# EAGLE board LEDSubMatrixHighDensity_v2 (EAGLE 9.6.2), part 1 of 2
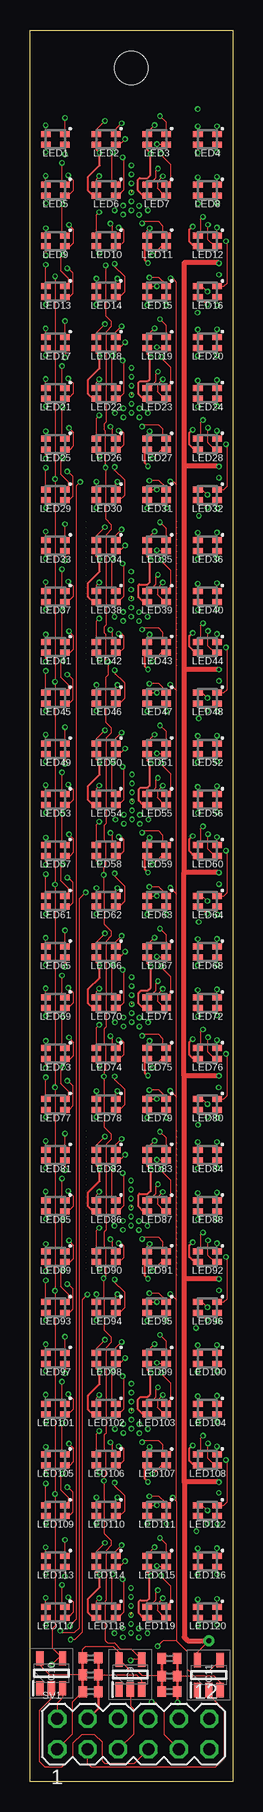
[diagram p2: board, top side]
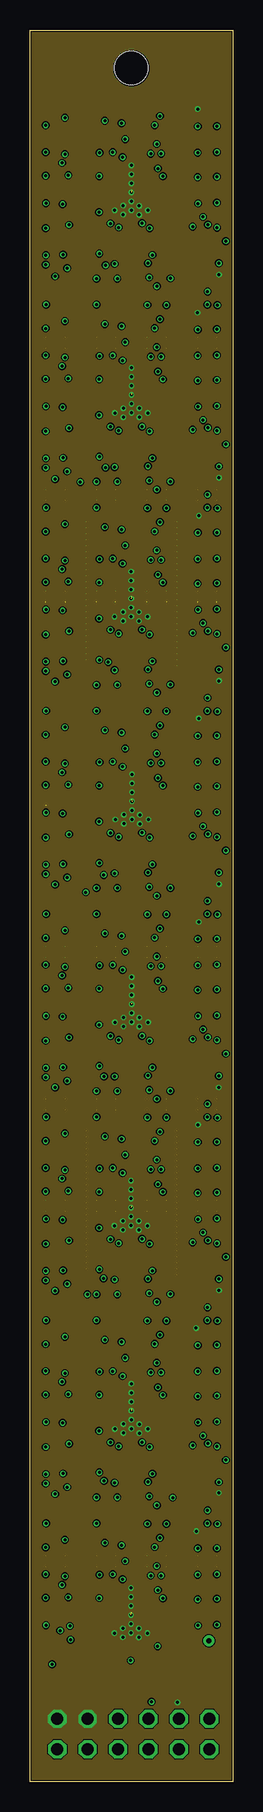
[diagram p3: board, inner layer InnerTop]
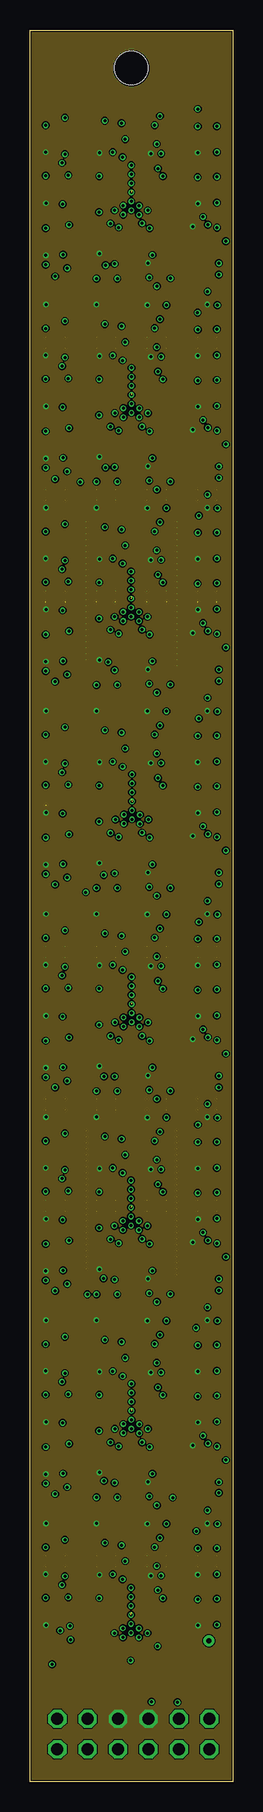
[diagram p4: board, inner layer InnerBottom]
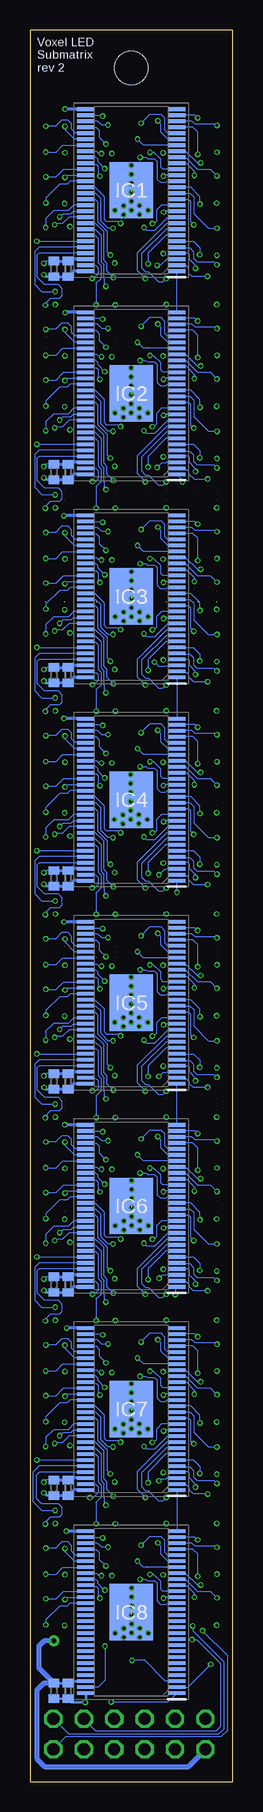
[diagram p5: board, bottom side, seen from below]

Size 16.93 x 146 mm. Coordinates in mm from the lower left corner, seen from the top.
Outline: 0,146 16.93,146 16.93,0 0,0 0,146
Copper layers (1+2*15+16): Top 0.035mm / dielectric 0.2mm / InnerTop 0.0175mm / dielectric 1.065mm / InnerBottom 0.0175mm / dielectric 0.2mm / Bottom 0.035mm
Design rules "jlcpcb_4layer_1oz": minimum track width 4mil, minimum drill 0.2mm, track to track 4mil, track to pad 0.2mm, pad to pad 5mil, via to via 6mil, smd to smd 5mil, copper to edge 5mil, drill to drill 0.5mm, minimum pad ring 10mil, minimum via ring 0.1mm, stop-mask expansion 0.1mm, vias tented up to drill 0mil, thermal gap 10mil
Holes 2.75 mm at 8.47,142.82

## Footprints (pad centres in the part's own frame; a part is rotated, then mirrored left to right if it is on the bottom)
C0402 = smd 0.7 x 0.9: 1 -0.65,0; 2 0.65,0
SOP50P810X120-57N = smd 1.475 x 0.3: 1 -3.788,6.75; 2 -3.788,6.25; 3 -3.788,5.75; 4 -3.788,5.25; 5 -3.788,4.75; 6 -3.788,4.25; 7 -3.788,3.75; 8 -3.788,3.25; 9 -3.788,2.75; 10 -3.788,2.25; 11 -3.788,1.75; 12 -3.788,1.25; 13 -3.788,0.75; 14 -3.788,0.25; 15 -3.788,-0.25; 16 -3.788,-0.75; 17 -3.788,-1.25; 18 -3.788,-1.75; 19 -3.788,-2.25; 20 -3.788,-2.75; 21 -3.788,-3.25; 22 -3.788,-3.75; 23 -3.788,-4.25; 24 -3.788,-4.75; 25 -3.788,-5.25; 26 -3.788,-5.75; 27 -3.788,-6.25; 28 -3.788,-6.75; 29 3.788,-6.75; 30 3.788,-6.25; 31 3.788,-5.75; 32 3.788,-5.25; 33 3.788,-4.75; 34 3.788,-4.25; 35 3.788,-3.75; 36 3.788,-3.25; 37 3.788,-2.75; 38 3.788,-2.25; 39 3.788,-1.75; 40 3.788,-1.25; 41 3.788,-0.75; 42 3.788,-0.25; 43 3.788,0.25; 44 3.788,0.75; 45 3.788,1.25; 46 3.788,1.75; 47 3.788,2.25; 48 3.788,2.75; 49 3.788,3.25; 50 3.788,3.75; 51 3.788,4.25; 52 3.788,4.75; 53 3.788,5.25; 54 3.788,5.75; 55 3.788,6.25; 56 3.788,6.75 | smd 3.61 x 4.7: 57 0,0
SOT95P280X145-5N = smd 1.2 x 0.6: 1 -1.25,0.95; 2 -1.25,0; 3 -1.25,-0.95; 4 1.25,-0.95; 5 1.25,0.95
B38G3RGB = smd 0.8 x 0.5: 1 0.8,0.45; 2 0.8,-0.45; 3 -0.8,-0.45; 4 -0.8,0.45
MA06-2 = drill 1.016 octagon: 1 -6.35,-1.27; 2 -6.35,1.27; 3 -3.81,-1.27; 4 -3.81,1.27; 5 -1.27,-1.27; 6 -1.27,1.27; 7 1.27,-1.27; 8 1.27,1.27; 9 3.81,-1.27; 10 3.81,1.27; 11 6.35,-1.27; 12 6.35,1.27

## Placement (x,y rotation side)
C1  .1uF  [C0402]  13.75,126.09 270 bottom
C1B  10uF  [C0402]  14.93,126.09 270 bottom
C2  .1uF  [C0402]  13.75,109.16 270 bottom
C2B  10uF  [C0402]  14.93,109.16 270 bottom
C3  .1uF  [C0402]  13.75,92.22 270 bottom
C3B  10uF  [C0402]  14.93,92.22 270 bottom
C4  .1uF  [C0402]  13.75,75.29 270 bottom
C4B  10uF  [C0402]  14.93,75.29 270 bottom
C5  .1uF  [C0402]  13.75,58.36 270 bottom
C5B  10uF  [C0402]  14.93,58.36 270 bottom
C6  .1uF  [C0402]  13.75,41.42 270 bottom
C6B  10uF  [C0402]  14.93,41.42 270 bottom
C7  .1uF  [C0402]  13.75,24.49 270 bottom
C7B  10uF  [C0402]  14.93,24.49 270 bottom
C8  .1uF  [C0402]  13.75,7.56 270 bottom
C8B  10uF  [C0402]  14.93,7.56 270 bottom
C28  0.1u  [C0402]  5.06,10.31 0 top
C29  4.7u  [C0402]  11.65,8.8 0 top
C30  0.1u  [C0402]  11.64,7.5 0 top
C31  4.7u  [C0402]  5.05,8.89 0 top
C32  0.1u  [C0402]  5.06,7.49 0 top
C33  4.7u  [C0402]  11.65,10.26 0 top
IC1  TLC5955DCAR  [SOP50P810X120-57N]  8.47,132.65 180 bottom
IC2  TLC5955DCAR  [SOP50P810X120-57N]  8.47,115.72 180 bottom
IC3  TLC5955DCAR  [SOP50P810X120-57N]  8.47,98.78 180 bottom
IC4  TLC5955DCAR  [SOP50P810X120-57N]  8.47,81.85 180 bottom
IC5  TLC5955DCAR  [SOP50P810X120-57N]  8.47,64.92 180 bottom
IC6  TLC5955DCAR  [SOP50P810X120-57N]  8.47,47.98 180 bottom
IC7  TLC5955DCAR  [SOP50P810X120-57N]  8.47,31.05 180 bottom
IC8  TLC5955DCAR  [SOP50P810X120-57N]  8.47,14.12 180 bottom
IC9  SN74LVC1G34DBVR  [SOT95P280X145-5N]  8.38,8.92 90 top
IC10  SN74LVC1G34DBVR  [SOT95P280X145-5N]  1.79,9.02 90 top
IC11  SN74LVC1G34DBVR  [SOT95P280X145-5N]  14.93,8.87 90 top
LED1  B38G3RGB  [B38G3RGB]  2.12,136.88 0 top
LED2  B38G3RGB  [B38G3RGB]  6.35,136.88 0 top
LED3  B38G3RGB  [B38G3RGB]  10.58,136.88 0 top
LED4  B38G3RGB  [B38G3RGB]  14.82,136.88 0 top
LED5  B38G3RGB  [B38G3RGB]  2.12,132.65 0 top
LED6  B38G3RGB  [B38G3RGB]  6.35,132.65 0 top
LED7  B38G3RGB  [B38G3RGB]  10.58,132.65 0 top
LED8  B38G3RGB  [B38G3RGB]  14.82,132.65 0 top
LED9  B38G3RGB  [B38G3RGB]  2.12,128.42 0 top
LED10  B38G3RGB  [B38G3RGB]  6.35,128.42 0 top
LED11  B38G3RGB  [B38G3RGB]  10.58,128.42 0 top
LED12  B38G3RGB  [B38G3RGB]  14.82,128.42 0 top
LED13  B38G3RGB  [B38G3RGB]  2.12,124.18 0 top
LED14  B38G3RGB  [B38G3RGB]  6.35,124.18 0 top
LED15  B38G3RGB  [B38G3RGB]  10.58,124.18 0 top
LED16  B38G3RGB  [B38G3RGB]  14.82,124.18 0 top
LED17  B38G3RGB  [B38G3RGB]  2.12,119.95 0 top
LED18  B38G3RGB  [B38G3RGB]  6.35,119.95 0 top
LED19  B38G3RGB  [B38G3RGB]  10.58,119.95 0 top
LED20  B38G3RGB  [B38G3RGB]  14.82,119.95 0 top
LED21  B38G3RGB  [B38G3RGB]  2.12,115.72 0 top
LED22  B38G3RGB  [B38G3RGB]  6.35,115.72 0 top
LED23  B38G3RGB  [B38G3RGB]  10.58,115.72 0 top
LED24  B38G3RGB  [B38G3RGB]  14.82,115.72 0 top
LED25  B38G3RGB  [B38G3RGB]  2.12,111.48 0 top
LED26  B38G3RGB  [B38G3RGB]  6.35,111.48 0 top
LED27  B38G3RGB  [B38G3RGB]  10.58,111.48 0 top
LED28  B38G3RGB  [B38G3RGB]  14.82,111.48 0 top
LED29  B38G3RGB  [B38G3RGB]  2.12,107.25 0 top
LED30  B38G3RGB  [B38G3RGB]  6.35,107.25 0 top
LED31  B38G3RGB  [B38G3RGB]  10.58,107.25 0 top
LED32  B38G3RGB  [B38G3RGB]  14.82,107.25 0 top
LED33  B38G3RGB  [B38G3RGB]  2.12,103.02 0 top
LED34  B38G3RGB  [B38G3RGB]  6.35,103.02 0 top
LED35  B38G3RGB  [B38G3RGB]  10.58,103.02 0 top
LED36  B38G3RGB  [B38G3RGB]  14.82,103.02 0 top
LED37  B38G3RGB  [B38G3RGB]  2.12,98.78 0 top
LED38  B38G3RGB  [B38G3RGB]  6.35,98.78 0 top
LED39  B38G3RGB  [B38G3RGB]  10.58,98.78 0 top
LED40  B38G3RGB  [B38G3RGB]  14.82,98.78 0 top
LED41  B38G3RGB  [B38G3RGB]  2.12,94.55 0 top
LED42  B38G3RGB  [B38G3RGB]  6.35,94.55 0 top
LED43  B38G3RGB  [B38G3RGB]  10.58,94.55 0 top
LED44  B38G3RGB  [B38G3RGB]  14.82,94.55 0 top
LED45  B38G3RGB  [B38G3RGB]  2.12,90.32 0 top
LED46  B38G3RGB  [B38G3RGB]  6.35,90.32 0 top
LED47  B38G3RGB  [B38G3RGB]  10.58,90.32 0 top
LED48  B38G3RGB  [B38G3RGB]  14.82,90.32 0 top
LED49  B38G3RGB  [B38G3RGB]  2.12,86.08 0 top
LED50  B38G3RGB  [B38G3RGB]  6.35,86.08 0 top
LED51  B38G3RGB  [B38G3RGB]  10.58,86.08 0 top
LED52  B38G3RGB  [B38G3RGB]  14.82,86.08 0 top
LED53  B38G3RGB  [B38G3RGB]  2.12,81.85 0 top
LED54  B38G3RGB  [B38G3RGB]  6.35,81.85 0 top
LED55  B38G3RGB  [B38G3RGB]  10.58,81.85 0 top
LED56  B38G3RGB  [B38G3RGB]  14.82,81.85 0 top
LED57  B38G3RGB  [B38G3RGB]  2.12,77.62 0 top
LED58  B38G3RGB  [B38G3RGB]  6.35,77.62 0 top
LED59  B38G3RGB  [B38G3RGB]  10.58,77.62 0 top
LED60  B38G3RGB  [B38G3RGB]  14.82,77.62 0 top
LED61  B38G3RGB  [B38G3RGB]  2.12,73.38 0 top
LED62  B38G3RGB  [B38G3RGB]  6.35,73.38 0 top
LED63  B38G3RGB  [B38G3RGB]  10.58,73.38 0 top
LED64  B38G3RGB  [B38G3RGB]  14.82,73.38 0 top
LED65  B38G3RGB  [B38G3RGB]  2.12,69.15 0 top
LED66  B38G3RGB  [B38G3RGB]  6.35,69.15 0 top
LED67  B38G3RGB  [B38G3RGB]  10.58,69.15 0 top
LED68  B38G3RGB  [B38G3RGB]  14.82,69.15 0 top
LED69  B38G3RGB  [B38G3RGB]  2.12,64.92 0 top
LED70  B38G3RGB  [B38G3RGB]  6.35,64.92 0 top
LED71  B38G3RGB  [B38G3RGB]  10.58,64.92 0 top
LED72  B38G3RGB  [B38G3RGB]  14.82,64.92 0 top
LED73  B38G3RGB  [B38G3RGB]  2.12,60.68 0 top
LED74  B38G3RGB  [B38G3RGB]  6.35,60.68 0 top
LED75  B38G3RGB  [B38G3RGB]  10.58,60.68 0 top
LED76  B38G3RGB  [B38G3RGB]  14.82,60.68 0 top
LED77  B38G3RGB  [B38G3RGB]  2.12,56.45 0 top
LED78  B38G3RGB  [B38G3RGB]  6.35,56.45 0 top
LED79  B38G3RGB  [B38G3RGB]  10.58,56.45 0 top
LED80  B38G3RGB  [B38G3RGB]  14.82,56.45 0 top
LED81  B38G3RGB  [B38G3RGB]  2.12,52.22 0 top
LED82  B38G3RGB  [B38G3RGB]  6.35,52.22 0 top
LED83  B38G3RGB  [B38G3RGB]  10.58,52.22 0 top
LED84  B38G3RGB  [B38G3RGB]  14.82,52.22 0 top
LED85  B38G3RGB  [B38G3RGB]  2.12,47.98 0 top
LED86  B38G3RGB  [B38G3RGB]  6.35,47.98 0 top
LED87  B38G3RGB  [B38G3RGB]  10.58,47.98 0 top
LED88  B38G3RGB  [B38G3RGB]  14.82,47.98 0 top
LED89  B38G3RGB  [B38G3RGB]  2.12,43.75 0 top
LED90  B38G3RGB  [B38G3RGB]  6.35,43.75 0 top
LED91  B38G3RGB  [B38G3RGB]  10.58,43.75 0 top
LED92  B38G3RGB  [B38G3RGB]  14.82,43.75 0 top
LED93  B38G3RGB  [B38G3RGB]  2.12,39.52 0 top
LED94  B38G3RGB  [B38G3RGB]  6.35,39.52 0 top
LED95  B38G3RGB  [B38G3RGB]  10.58,39.52 0 top
LED96  B38G3RGB  [B38G3RGB]  14.82,39.52 0 top
LED97  B38G3RGB  [B38G3RGB]  2.12,35.28 0 top
LED98  B38G3RGB  [B38G3RGB]  6.35,35.28 0 top
LED99  B38G3RGB  [B38G3RGB]  10.58,35.28 0 top
LED100  B38G3RGB  [B38G3RGB]  14.82,35.28 0 top
LED101  B38G3RGB  [B38G3RGB]  2.12,31.05 0 top
LED102  B38G3RGB  [B38G3RGB]  6.35,31.05 0 top
LED103  B38G3RGB  [B38G3RGB]  10.58,31.05 0 top
LED104  B38G3RGB  [B38G3RGB]  14.82,31.05 0 top
LED105  B38G3RGB  [B38G3RGB]  2.12,26.82 0 top
LED106  B38G3RGB  [B38G3RGB]  6.35,26.82 0 top
LED107  B38G3RGB  [B38G3RGB]  10.58,26.82 0 top
LED108  B38G3RGB  [B38G3RGB]  14.82,26.82 0 top
LED109  B38G3RGB  [B38G3RGB]  2.12,22.58 0 top
LED110  B38G3RGB  [B38G3RGB]  6.35,22.58 0 top
LED111  B38G3RGB  [B38G3RGB]  10.58,22.58 0 top
LED112  B38G3RGB  [B38G3RGB]  14.82,22.58 0 top
LED113  B38G3RGB  [B38G3RGB]  2.12,18.35 0 top
LED114  B38G3RGB  [B38G3RGB]  6.35,18.35 0 top
LED115  B38G3RGB  [B38G3RGB]  10.58,18.35 0 top
LED116  B38G3RGB  [B38G3RGB]  14.82,18.35 0 top
LED117  B38G3RGB  [B38G3RGB]  2.12,14.12 0 top
LED118  B38G3RGB  [B38G3RGB]  6.35,14.12 0 top
LED119  B38G3RGB  [B38G3RGB]  10.58,14.12 0 top
LED120  B38G3RGB  [B38G3RGB]  14.82,14.12 0 top
SV1  [MA06-2]  8.63,3.95 0 top

## Tracks (layer width: path | path; a pad name or v marks a point on that pad's centre or on a via)
3V3  (via drill 0.25)  (29 unrouted)
  Top 0.152: LED1.3 v1.32,135.81 | LED2.3 5.55,136.03 v5.82,135.76 5.82,134.73 4.87,133.78 4.87,132.6 5.27,132.2 LED6.3 | LED3.3 9.78,136 v10.09,135.7 10.02,135.63 10.02,133.84 9.83,133.65 9.16,133.65 9.04,133.53 9.04,132.61 9.45,132.2 LED7.3 | LED5.3 1.34,132.18 v1.34,131.56 | LED9.3 1.32,127.24 v1.33,127.22 | LED10.3 5.55,127.61 v5.79,127.36 | v9.85,126.57 9.57,126.85 9.57,127.75 LED11.3 | LED15.3 9.78,123.1 v9.8,123.08 | LED14.3 v5.55,123.12 | LED13.3 1.32,123.14 v1.34,123.12 | v14.81,123.11 14.19,123.73 LED16.3 | LED8.3 14.02,131.56 v14.04,131.54 | LED4.3 14,136.42 v14,135.77 | LED12.3 13.68,127.97 13.29,128.36 13.29,129.36 13.54,129.61 v13.59,129.61 | LED17.3 v1.32,118.88 | LED18.3 5.55,119.09 v5.82,118.83 5.82,117.79 4.87,116.85 4.87,115.67 5.27,115.27 LED22.3 | LED19.3 9.78,119.07 v10.09,118.77 9.98,118.66 9.98,116.87 9.83,116.72 9.17,116.72 9.08,116.62 9.08,115.64 9.45,115.27 LED23.3 | LED21.3 1.34,115.24 v1.34,114.63 | LED25.3 1.32,110.3 v1.33,110.29 | LED26.3 5.55,110.67 v5.79,110.43 | v9.85,109.64 9.57,109.92 9.57,110.82 LED27.3 | LED31.3 9.78,106.16 v9.8,106.15 | LED30.3 v5.55,106.19 v5.55,106.18 | LED29.3 1.32,106.21 v1.34,106.18 | v14.81,106.17 14.19,106.8 LED32.3 | LED24.3 14.02,114.62 v14.04,114.6 | LED20.3 14,119.49 v14,118.84 | LED28.3 13.71,111.03 13.32,111.42 13.32,112.45 13.54,112.68 v13.59,112.68 | LED33.3 v1.32,101.95 | LED34.3 5.55,102.16 v5.82,101.89 5.82,100.86 4.87,99.91 4.87,98.73 5.27,98.33 LED38.3 | LED35.3 9.78,102.13 v10.09,101.83 10,101.74 10,99.95 9.83,99.78 9.15,99.78 9.06,99.7 9.06,98.73 9.45,98.33 LED39.3 | LED37.3 1.34,98.31 v1.34,97.69 | LED41.3 1.32,93.37 v1.33,93.36
  Top 0.152: LED42.3 5.55,93.74 v5.79,93.5 | v9.85,92.7 9.57,92.98 9.57,93.88 LED43.3 | LED47.3 9.78,89.23 v9.8,89.21 | LED46.3 v5.55,89.25 | LED45.3 1.32,89.28 v1.34,89.25 | v14.81,89.24 14.19,89.87 LED48.3 | LED40.3 14.02,97.69 v14.04,97.67 | LED36.3 14,102.55 v14,101.91 | LED44.3 13.81,94.1 13.29,94.62 13.29,95.49 13.54,95.75 v13.59,95.75 | LED49.3 v1.32,85.02 | LED50.3 5.55,85.22 v5.82,84.96 5.82,83.93 4.87,82.98 4.87,81.8 5.27,81.4 LED54.3 | LED51.3 9.78,85.2 v10.09,84.9 9.99,84.8 9.99,83.01 9.83,82.85 9.21,82.85 9.09,82.73 9.09,81.77 9.45,81.4 LED55.3 | 1.34,81.38 v1.34,80.76 | LED57.3 1.32,76.44 v1.33,76.42 | LED58.3 5.55,76.81 v5.79,76.56 | v9.85,75.77 9.57,76.05 9.57,76.95 LED59.3 | LED63.3 9.78,72.3 v9.8,72.28 | LED62.3 v5.55,72.32 | LED61.3 1.32,72.34 v1.34,72.32 | v14.81,72.31 14.19,72.93 LED64.3 | v14.04,80.74 14.02,80.75 LED56.3 | LED52.3 14,85.62 v14,84.97 | LED60.3 13.71,77.17 13.31,77.56 13.31,78.58 13.54,78.81 v13.59,78.81 | LED65.3 v1.32,68.08 | LED66.3 5.55,68.29 v5.82,68.03 5.82,66.99 4.87,66.05 4.87,64.87 5.27,64.47 LED70.3 | LED67.3 9.78,68.27 v10.09,67.97 10.06,67.94 10.06,66.15 9.83,65.92 9.27,65.92 9.07,65.72 9.07,64.85 9.45,64.47 LED71.3 | LED69.3 1.34,64.44 v1.34,63.83 | LED73.3 1.32,59.5 v1.33,59.49 | LED74.3 5.55,59.88 v5.79,59.63 | v9.85,58.84 9.57,59.12 9.57,60.02 LED75.3 | LED79.3 9.78,55.36 v9.8,55.35 | LED78.3 v5.55,55.39 v5.55,55.38 | LED77.3 1.32,55.41 v1.34,55.38 | v14.81,55.38 14.19,56 LED80.3 | LED72.3 14.02,63.82 v14.04,63.8 | LED68.3 14,68.69 v14,68.04 | LED76.3 13.64,60.23 13.33,60.55 13.33,61.66 13.54,61.88 v13.59,61.88 | LED81.3 v1.32,51.15 | LED82.3 5.55,51.36 v5.82,51.09 5.82,50.06 4.87,49.11 4.87,47.93 5.27,47.53 LED86.3
  Top 0.152: LED83.3 9.78,51.33 v10.09,51.03 10.06,51.01 10.06,49.22 9.83,48.98 9.15,48.98 9.07,48.91 9.07,47.92 9.45,47.53 LED87.3 | LED85.3 1.34,47.51 v1.34,46.89 | LED89.3 1.32,42.57 v1.33,42.56 | LED90.3 5.55,42.94 v5.79,42.7 | v9.85,41.9 9.57,42.19 9.57,43.08 LED91.3 | LED95.3 9.78,38.43 v9.8,38.41 | LED94.3 v5.55,38.45 | LED93.3 1.32,38.47 v1.34,38.45 | v14.81,38.44 14.19,39.07 LED96.3 | LED88.3 14.02,46.89 v14.04,46.87 | LED84.3 14,51.75 v14,51.11 | LED92.3 13.72,43.3 13.3,43.72 13.3,44.7 13.54,44.94 v13.59,44.94 | LED97.3 v1.32,34.22 | LED98.3 5.55,34.42 v5.82,34.16 5.82,33.13 4.87,32.18 4.87,31 5.27,30.6 LED102.3 | LED99.3 9.78,34.4 v10.09,34.1 10.01,34.02 10.01,32.23 9.83,32.05 9.23,32.05 9.04,31.86 9.04,31.01 9.45,30.6 LED103.3 | LED101.3 1.34,30.58 v1.34,29.96 | LED105.3 1.32,25.64 v1.33,25.62 | LED106.3 5.55,26.01 v5.79,25.77 | v9.85,24.97 9.57,25.25 9.57,26.15 LED107.3 | LED111.3 9.78,21.5 v9.8,21.48 | LED110.3 v5.55,21.52 | LED109.3 1.32,21.54 v1.34,21.52 | v14.81,21.51 14.19,22.13 LED112.3 | LED104.3 14.02,29.95 v14.04,29.94 | LED100.3 14,34.82 v14,34.17 | LED108.3 13.68,26.37 13.3,26.75 13.3,27.77 13.54,28.01 v13.59,28.01 | LED113.3 v1.32,17.28 | LED114.3 5.55,17.49 v5.82,17.23 5.82,16.19 4.87,15.25 4.87,14.07 5.27,13.67 LED118.3 | LED115.3 9.78,17.47 v10.09,17.16 9.94,17.02 9.94,15.23 9.83,15.12 9.2,15.12 9.1,15.01 9.1,14.03 9.45,13.67 LED119.3 | LED117.3 1.34,13.64 v1.34,13.03 | LED120.3 14.02,13.02 v14.04,13 | LED116.3 14,17.89 v14,17.24
  pour InnerBottom (no thermals): -17,163 34,163 34,-24 -17,-24
3V3_LOGIC  (via drill 0.25, 0.4 pad 0.9)  (2 unrouted)
  Top 0.102: SV1.1 3.58,3.98 3.58,6.65 C32.1 | C31.1 1.63,8.89 0.84,9.68 IC10.5 | C28.1 4.41,11.01 4.66,11.26 6.94,11.26 7.43,10.77 IC9.5 8.42,9.18 9.02,9.18 9.4,8.8 C29.1 | IC11.5 13.98,10.78 v14.93,11.73
  Top 0.203: C28.1 C31.1 4.41,8.88 C32.1 | C33.1 C29.1 11,7.51 C30.1
  Top 0.406: v15.78,126.56 15.75,126.59 12.86,126.59 12.86,109.63 | v15.78,109.62 v15.78,109.63 12.86,109.63 | v15.78,92.69 12.86,92.69 | v15.78,75.76 12.86,75.76 | 12.86,58.83 12.86,75.76 | v15.78,58.83 12.86,58.83 | v15.78,41.89 12.86,41.89 | v15.78,24.96 12.89,24.96 | 12.89,24.96 12.86,24.96 12.86,41.89 | 12.89,24.96 12.89,12.04 13.21,11.73 v14.93,11.73 | 12.86,109.63 12.86,92.69 | 12.86,92.69 12.86,75.76 | 12.86,58.83 12.86,41.89
  Bottom 0.102: C1B.1 15.6,126.74 v15.78,126.56 | C2B.1 15.6,109.81 v15.78,109.62 | C3B.1 15.6,92.87 v15.78,92.69 | C4B.1 15.6,75.94 v15.78,75.76 | C5B.1 15.6,59.01 v15.78,58.83 | C6B.1 15.6,42.07 v15.78,41.89 | C7B.1 15.6,25.14 v15.78,24.96
  Bottom 0.203: IC8.54 13.59,8.37 C8.1 C8B.1
  Bottom 0.254: IC1.54 13.59,126.9 C1.1 C1B.1 | IC2.54 13.59,109.97 C2.1 C2B.1 | IC3.54 13.59,93.03 C3.1 C3B.1 | IC4.54 13.59,76.1 C4.1 C4B.1 | IC5.54 13.59,59.17 C5.1 C5B.1 | IC6.54 13.59,42.23 C6.1 C6B.1 | IC7.54 13.59,25.3 C7.1 C7B.1
  Bottom 0.406: v14.93,11.73 15.74,11.73 16.19,11.28 16.19,9.46 C8B.1 15.78,8.21 16.37,7.62 16.37,1.9 15.72,1.25 3.7,1.25 2.28,2.67 SV1.1
GND  (via drill 0.25)  (8 unrouted)
  Top 0.102: IC10.3 2.74,6.96 2.28,6.5 SV1.2 | C31.2 8.89,8.89 9.33,8.44 IC9.3 | C29.2 15.37,8.8 15.88,8.28 IC11.3
  Top 0.203: C28.2 C31.2 C32.2 5.71,6.12 SV1.4 | C33.2 C29.2 12.3,7.51 C30.2 12.29,6.63 v12.32,6.6
  Bottom 0.203: C7B.2 15.55,23.84 v15.77,24.06 | C6B.2 15.61,40.77 v15.78,40.94 | C5B.2 15.61,57.71 v15.76,57.86 | C4B.2 15.61,74.64 v15.78,74.81 | C3B.2 15.61,91.57 v15.78,91.74 | C2B.2 15.61,108.51 v15.78,108.67 | C1B.2 15.61,125.44 v15.78,125.61 | IC8.56 12.26,6.67 v12.32,6.6 13.44,6.6 C8.2 C8B.2
  Bottom 0.254: v14.02,139.42 14,139.4 IC1.29 | C1B.2 C1.2 13.29,125.9 IC1.56 | IC2.56 13.29,108.97 C2.2 C2B.2 | IC3.56 13.29,92.03 C3.2 C3B.2 | IC3.29 14.08,105.53 v14.1,105.52 | IC4.29 14.08,88.6 v14.1,88.62 | IC4.56 13.29,75.1 C4.2 C4B.2 | IC5.29 14.08,71.67 v14.1,71.65 | IC5.56 13.29,58.17 C5.2 C5B.2 | IC6.29 14.01,54.73 v14.03,54.75 | IC6.56 13.29,41.23 C6.2 C6B.2 | IC7.29 v13.86,37.8 v13.87,37.81 | C7B.2 C7.2 13.29,24.3 IC7.56 | IC8.29 v13.89,20.87 v13.9,20.87 | IC2.29 13.97,122.47 v14,122.44
  other vias: 8.46,134.72 8.46,133.97 8.46,133.22 8.46,132.47 8.46,131.72 8.46,130.97 9.12,131.35 7.79,131.36 7.79,130.61 9.12,130.6 7.07,130.96 9.83,130.96 8.44,16.14 8.44,15.39 8.44,14.64 8.44,13.89 8.44,13.14 8.44,12.39 9.09,12.76 7.76,12.77 7.76,12.02 9.09,12.01 7.05,12.37 9.81,12.37 8.47,33.16 8.47,32.41 8.47,31.66 8.47,30.91 8.47,30.16 8.47,29.41 9.13,29.78 7.8,29.8 7.8,29.05 9.13,29.03 7.08,29.39 9.84,29.39 8.44,50.09 8.44,49.34 8.44,48.59 8.44,47.84 8.44,47.09 8.44,46.34 9.09,46.72 7.76,46.73 7.76,45.98 9.09,45.97 7.05,46.33 9.81,46.33 8.49,67.05 8.49,66.3 8.49,65.55 8.49,64.8 8.49,64.05 8.49,63.3 9.14,63.67 7.81,63.69 7.81,62.94 9.14,62.92 7.1,63.28 9.86,63.28 8.52,83.95 8.52,83.2 8.52,82.45 8.52,81.7 8.52,80.95 8.52,80.2 9.18,80.58 7.85,80.59 7.85,79.84 9.18,79.83 7.14,80.19 9.9,80.19 8.45,100.85 8.45,100.1 8.45,99.35 8.45,98.6 8.45,97.85 8.45,97.1 9.11,97.48 7.78,97.49 7.78,96.74 9.11,96.73 7.06,97.09 9.82,97.09 8.48,117.83 8.48,117.08 8.48,116.33 8.48,115.58 8.48,114.83 8.48,114.08 9.13,114.46 7.8,114.47 7.8,113.72 9.13,113.71 7.09,114.07 9.85,114.07
  pour InnerTop (no thermals): -16,162 32,162 32,82 32,-14 -16,-14
GSCLK  (via drill 0.25)
  Top 0.102: IC11.4 14.95,9.19 13.31,9.19 13.14,9.36 13.14,10.81 12.22,11.72 | 12.22,23.36 12.22,11.72 | 12.22,23.36 12.22,40.13 | 12.22,40.13 12.22,57.06 | 12.22,57.06 12.22,74 | 12.22,74 12.22,90.93 | 12.22,90.93 12.22,108.12 | 12.22,108.12 12.22,125 11.93,125.29 v11.74,125.29 | v11.72,108.37 11.97,108.37 12.22,108.12 | v11.72,91.43 12.22,90.93 | v11.73,74.49 12.22,74 | v11.72,57.57 12.22,57.06 | v11.72,40.63 12.22,40.13 | v11.92,23.66 12.22,23.36 | 12.22,11.72 11.1,11.72 v10.66,11.28
  Bottom 0.102: IC1.55 11.47,126.4 11.24,126.17 11.24,125.66 11.61,125.29 v11.74,125.29 | IC7.55 11.51,24.8 11.27,24.55 11.27,24.05 11.65,23.66 v11.92,23.66 | IC2.55 11.46,109.47 11.27,109.27 11.27,108.56 11.46,108.37 v11.72,108.37 | IC3.55 12.15,92.43 11.41,92.43 11.27,92.29 11.27,91.78 11.61,91.43 v11.72,91.43 | IC4.55 11.51,75.6 11.27,75.35 11.27,74.77 11.54,74.49 v11.73,74.49 | IC5.55 11.51,58.67 11.27,58.42 11.27,57.78 11.48,57.57 v11.72,57.57 | IC6.55 11.51,41.73 11.27,41.49 11.27,40.93 11.56,40.63 v11.72,40.63 | v10.66,11.28 10.66,8.43 11.23,7.87 IC8.55
GSCLK_FPGA
  Top 0.102: IC11.2 14.93,7.24 16.2,5.97 16.2,1.91 15.47,1.18 5.13,1.18 4.82,1.49 SV1.3
LAT  (via drill 0.25)
  Top 0.102: v6.32,126.38 6.32,122.18 6.79,121.71 6.79,121.27 6.34,120.83 6.34,113.31 6.19,113.16 6.19,112.72 6.32,112.58 6.32,110.21 6.31,110.2 v6.31,109.53 6.31,105.25 6.79,104.78 6.79,104.34 6.34,103.9 6.34,96.38 6.19,96.22 6.19,95.78 6.32,95.65 6.32,93.52 v6.54,93.31 6.54,92.25 6.32,92.03 6.32,88.31 6.79,87.84 6.79,87.41 6.34,86.97 6.34,79.84 6.19,79.68 6.19,78.43 6.32,78.3 6.32,76.35 6.16,76.18 v6.16,75.57 6.16,74.23 6.2,74.19 6.2,71.5 6.79,70.91 6.79,70.47 6.34,70.03 6.34,62.9 6.19,62.75 6.19,61.5 6.32,61.36 6.32,59.41 6.17,59.26 v6.17,58.77 6.17,57.28 6.2,57.25 6.2,54.56 6.79,53.98 6.79,53.54 6.34,53.1 6.34,45.97 6.19,45.81 6.19,44.57 6.32,44.43 6.32,42.13 v6.14,41.95 6.14,40.38 6.2,40.32 6.2,37.63 6.79,37.05 6.79,36.61 6.34,36.17 6.34,29.04 6.19,28.88 6.19,27.63 6.32,27.5 6.32,25.55 6.18,25.4 v6.18,25.06 6.18,23.41 6.2,23.39 6.2,20.7 6.79,20.11 6.79,19.67 6.34,19.23 6.34,15.09 6.25,15 6.25,11.79 6.5,11.54 7.05,11.54 7.51,11.08 8.42,11.08 IC9.4 8.5,10.17 v8.42,10.09
  Bottom 0.102: IC1.3 5.51,126.9 6.03,126.38 v6.32,126.38 | IC2.3 5.51,109.97 5.57,109.9 5.94,109.9 v6.31,109.53 | IC3.3 5.51,93.03 5.57,92.97 6.2,92.97 v6.54,93.31 | v6.16,75.57 5.69,76.03 5.57,76.03 5.51,76.1 IC4.3 | v6.17,58.77 5.84,59.1 5.57,59.1 5.51,59.17 IC5.3 | IC6.3 5.51,42.23 5.57,42.17 5.92,42.17 v6.14,41.95 | v6.18,25.06 6,25.23 5.57,25.23 5.51,25.3 IC7.3 | IC8.3 5.62,8.37 7.35,10.09 v8.42,10.09
LAT_FPGA
  Top 0.102: IC9.2 8.38,6.32 8.63,6.07 8.63,3.96 SV1.5
N$LEDB1  (via drill 0.25)
  Top 0.102: LED1.2 v2.92,135.64
  Bottom 0.102: v2.92,135.64 2.92,137.5 3.32,137.9 IC1.25
N$LEDB2  (via drill 0.25)
  Top 0.102: v7.96,136.91 7.49,136.43 LED2.2
  Bottom 0.102: IC1.22 7.45,136.4 v7.96,136.91
N$LEDB3  (via drill 0.25)
  Top 0.102: LED3.2 10.65,136.43 v10.59,136.5
  Bottom 0.102: IC1.32 11.42,137.9 11.15,137.63 11.15,137.06 v10.59,136.5
N$LEDB4  (via drill 0.25)
  Top 0.102: LED4.2 v15.62,135.82
  Bottom 0.102: v15.62,135.82 14.77,135.82 14.18,136.4 IC1.35
N$LEDB5  (via drill 0.25)
  Top 0.102: v3.21,133.89 3.6,133.5 3.6,132.62 3.18,132.2 LED5.2
  Bottom 0.102: IC1.19 3.89,134.9 3.21,134.22 v3.21,133.89
N$LEDB6  (via drill 0.25)
  Top 0.102: v7.74,135.39 7.82,135.3 7.82,132.63 7.39,132.2 LED6.2
  Bottom 0.102: v7.74,135.39 7.24,135.39 7.13,135.28 6.53,135.28 6.33,135.08 6.33,133.57 6.04,133.29 5.57,133.29 5.46,133.4 IC1.16
N$LEDB7  (via drill 0.25)
  Top 0.102: LED7.2 11.23,132.2 10.63,132.8 10.63,133.35 v11.09,133.81
  Bottom 0.102: IC1.38 12.15,134.8 11.41,134.8 11.26,134.64 11.26,133.98 v11.09,133.81
N$LEDB8  (via drill 0.25)
  Top 0.102: LED8.2 v15.62,131.6 v15.61,131.6
  Bottom 0.102: IC1.41 13.57,133.4 13.82,133.15 14.46,133.15 15.61,132 v15.61,131.6
N$LEDB9  (via drill 0.25)
  Top 0.102: v3.26,129.76 3.62,129.4 3.62,128.22 3.36,127.97 LED9.2
  Bottom 0.102: IC1.13 3.69,131.9 3.52,131.73 3.52,130.01 v3.26,129.76
N$LEDB10  (via drill 0.25)
  Top 0.102: v7.42,129.54 7.63,129.54 7.8,129.37 7.8,128.31 7.45,127.97 LED10.2
  Bottom 0.102: IC1.10 5.43,130.4 6.51,129.31 7.18,129.31 v7.42,129.54
N$LEDB11  (via drill 0.25)
  Top 0.102: LED11.2 10.99,127.97 10.27,127.25 v10.22,127.25
  Bottom 0.102: v10.22,127.25 10.52,127.54 10.52,129.25 11.26,129.99 11.26,131.64 11.51,131.9 IC1.44
N$LEDB12  (via drill 0.25)
  Top 0.102: LED12.2 15.43,127.97 14.87,128.53 v14.87,129.78
  Bottom 0.102: IC1.47 13.68,130.4 14.2,129.88 14.76,129.88 v14.87,129.78
N$LEDB13  (via drill 0.25)
  Top 0.102: v3.11,126.14 3.19,126.14 3.57,125.76 3.57,124.03 3.28,123.73 LED13.2
  Bottom 0.102: v3.11,126.14 3.11,126.39 3.64,126.91 3.64,127.28 3.75,127.4 IC1.4
N$LEDB14  (via drill 0.25)
  Top 0.102: v7.08,126.5 7.08,126.27 7.88,125.46 7.88,124.14 7.47,123.73 LED14.2
  Bottom 0.102: IC1.7 5.56,128.9 7.08,127.39 v7.08,126.5
N$LEDB15  (via drill 0.25)
  Top 0.102: LED15.2 v11.38,123.09 v11.39,123.08
  Bottom 0.102: v11.39,123.08 11.39,124.88 10.99,125.28 10.99,126.35 11.25,126.6 11.25,128.65 11.5,128.9 IC1.50
N$LEDB16  (via drill 0.25)
  Top 0.102: v15.65,123.06 15.65,123.7 LED16.2
  Bottom 0.102: v15.65,123.06 15.65,123.19 15.19,123.65 14.44,123.65 14.23,123.86 14.23,124.44 14.56,124.77 15.69,124.77 16.31,125.39 16.31,127.25 16.14,127.42 12.28,127.42 IC1.53
N$LEDB17  (via drill 0.25)  (1 unrouted)
  Top 0.102: LED17.2 v2.92,118.71
  Bottom 0.102: v2.92,118.71 2.92,120.56 3.32,120.97 IC2.25
N$LEDB18  (via drill 0.25)  (1 unrouted)
  Top 0.102: v7.96,119.97 7.49,119.5 LED18.2
  Bottom 0.102: IC2.22 7.45,119.47 v7.96,119.97
N$LEDB19  (via drill 0.25)  (1 unrouted)
  Top 0.102: LED19.2 10.65,119.5 v10.59,119.56
  Bottom 0.102: IC2.32 11.42,120.97 11.15,120.7 11.15,120.13 v10.59,119.56
N$LEDB20  (via drill 0.25)  (1 unrouted)
  Top 0.102: LED20.2 v15.62,118.88
  Bottom 0.102: v15.62,118.88 14.77,118.88 14.18,119.47 IC2.35
N$LEDB21  (via drill 0.25)
  Top 0.102: v3.21,116.96 3.6,116.57 3.6,115.69 3.18,115.27 LED21.2
  Bottom 0.102: IC2.19 3.89,117.97 3.21,117.29 v3.21,116.96
N$LEDB22  (via drill 0.25)
  Top 0.102: v7.74,118.45 7.82,118.37 7.82,115.7 7.39,115.27 LED22.2
  Bottom 0.102: v7.74,118.45 7.24,118.45 7.13,118.34 6.53,118.34 6.33,118.14 6.33,116.64 6.04,116.36 5.57,116.36 5.46,116.47 IC2.16
N$LEDB23  (via drill 0.25)
  Top 0.102: LED23.2 11.23,115.27 10.63,115.87 10.63,116.42 v11.09,116.88
  Bottom 0.102: IC2.38 12.15,117.87 11.41,117.87 11.26,117.71 11.26,117.04 v11.09,116.88
N$LEDB24  (via drill 0.25)
  Top 0.102: LED24.2 v15.62,114.67 v15.61,114.66
  Bottom 0.102: IC2.41 13.57,116.47 13.82,116.22 14.46,116.22 15.61,115.07 v15.61,114.66
N$LEDB25  (via drill 0.25)
  Top 0.102: v3.26,112.82 3.62,112.46 3.62,111.29 3.36,111.03 LED25.2
  Bottom 0.102: IC2.13 3.69,114.97 3.52,114.8 3.52,113.08 v3.26,112.82
N$LEDB26  (via drill 0.25)
  Top 0.102: v7.42,112.61 7.63,112.61 7.8,112.44 7.8,111.38 7.45,111.03 LED26.2
  Bottom 0.102: IC2.10 5.43,113.47 6.51,112.38 7.18,112.38 v7.42,112.61
N$LEDB27  (via drill 0.25)
  Top 0.102: LED27.2 10.99,111.03 10.27,110.31 v10.22,110.31
  Bottom 0.102: v10.22,110.31 10.52,110.6 10.52,112.31 11.26,113.06 11.26,114.71 11.51,114.97 IC2.44
N$LEDB28  (via drill 0.25)
  Top 0.102: LED28.2 15.43,111.03 14.87,111.59 v14.87,112.84
  Bottom 0.102: IC2.47 13.68,113.47 14.2,112.94 14.76,112.94 v14.87,112.84
N$LEDB29  (via drill 0.25)  (1 unrouted)
  Top 0.102: v3.11,109.21 3.19,109.21 3.57,108.83 3.57,107.09 3.28,106.8 LED29.2
  Bottom 0.102: v3.11,109.21 3.11,109.45 3.64,109.98 3.64,110.35 3.75,110.47 IC2.4
N$LEDB30  (via drill 0.25)  (1 unrouted)
  Top 0.102: v7.08,109.57 7.08,109.33 7.88,108.53 7.88,107.21 7.47,106.8 LED30.2
  Bottom 0.102: IC2.7 5.56,111.97 7.08,110.45 v7.08,109.57
N$LEDB31  (via drill 0.25)  (1 unrouted)
  Top 0.102: LED31.2 11.38,106.15 v11.39,106.14
  Bottom 0.102: v11.39,106.14 11.39,107.94 10.99,108.35 10.99,109.41 11.25,109.67 11.25,111.72 11.5,111.97 IC2.50
N$LEDB32  (via drill 0.25)  (1 unrouted)
  Top 0.102: v15.65,106.13 15.65,106.77 LED32.2
  Bottom 0.102: v15.65,106.13 15.65,106.26 15.19,106.72 14.44,106.72 14.23,106.93 14.23,107.5 14.56,107.83 15.69,107.83 16.31,108.45 16.31,110.32 16.14,110.49 12.28,110.49 IC2.53
N$LEDB33  (via drill 0.25)  (1 unrouted)
  Top 0.102: LED33.2 v2.92,101.78 v2.92,101.77
  Bottom 0.102: v2.92,101.77 2.92,103.63 3.32,104.03 IC3.25
N$LEDB34  (via drill 0.25)  (1 unrouted)
  Top 0.102: v7.96,103.04 7.49,102.57 LED34.2
  Bottom 0.102: IC3.22 7.45,102.53 v7.96,103.04
N$LEDB35  (via drill 0.25)  (1 unrouted)
  Top 0.102: LED35.2 10.65,102.57 v10.59,102.63
  Bottom 0.102: IC3.32 11.42,104.03 11.15,103.77 11.15,103.2 v10.59,102.63
N$LEDB36  (via drill 0.25)  (1 unrouted)
  Top 0.102: LED36.2 v15.62,101.95
  Bottom 0.102: v15.62,101.95 14.77,101.95 14.18,102.53 IC3.35
N$LEDB37  (via drill 0.25)  (2 unrouted)
  Top 0.102: v3.21,100.02 3.6,99.63 3.6,98.75 3.18,98.33 LED37.2
  Bottom 0.102: IC3.19 3.89,101.03 3.21,100.35 v3.21,100.02
N$LEDB38  (via drill 0.25)  (2 unrouted)
  Top 0.102: v7.74,101.52 7.82,101.44 7.82,98.76 7.39,98.33 LED38.2
  Bottom 0.102: v7.74,101.52 7.24,101.52 7.13,101.41 6.53,101.41 6.33,101.21 6.33,99.71 6.04,99.42 5.57,99.42 5.46,99.53 IC3.16
N$LEDB39  (via drill 0.25)  (2 unrouted)
  Top 0.102: LED39.2 11.23,98.33 10.63,98.94 10.63,99.49 v11.09,99.95
  Bottom 0.102: IC3.38 12.15,100.93 11.41,100.93 11.26,100.78 11.26,100.11 v11.09,99.95
N$LEDB40  (via drill 0.25)  (2 unrouted)
  Top 0.102: LED40.2 v15.62,97.73 v15.61,97.73
  Bottom 0.102: IC3.41 13.57,99.53 13.82,99.28 14.46,99.28 15.61,98.13 v15.61,97.73
N$LEDB41  (via drill 0.25)  (1 unrouted)
  Top 0.102: v3.26,95.89 3.62,95.53 3.62,94.36 3.36,94.1 LED41.2
  Bottom 0.102: IC3.13 3.69,98.03 3.52,97.86 3.52,96.15 v3.26,95.89
N$LEDB42  (via drill 0.25)  (1 unrouted)
  Top 0.102: v7.42,95.67 7.63,95.67 7.8,95.5 7.8,94.45 7.45,94.1 LED42.2
  Bottom 0.102: IC3.10 5.43,96.53 6.51,95.44 7.18,95.44 v7.42,95.67
N$LEDB43  (via drill 0.25)  (1 unrouted)
  Top 0.102: LED43.2 10.99,94.1 10.27,93.38 v10.22,93.38
  Bottom 0.102: v10.22,93.38 10.52,93.67 10.52,95.38 11.26,96.12 11.26,97.78 11.51,98.03 IC3.44
N$LEDB44  (via drill 0.25)  (1 unrouted)
  Top 0.102: LED44.2 15.43,94.1 14.87,94.66 v14.87,95.91
  Bottom 0.102: IC3.47 13.68,96.53 14.2,96.01 14.76,96.01 v14.87,95.91
N$LEDB45  (via drill 0.25)  (1 unrouted)
  Top 0.102: v3.11,92.27 3.19,92.27 3.57,91.89 3.57,90.16 3.28,89.87 LED45.2
  Bottom 0.102: v3.11,92.27 3.11,92.52 3.64,93.05 3.64,93.42 3.75,93.53 IC3.4
N$LEDB46  (via drill 0.25)  (1 unrouted)
  Top 0.102: v7.08,92.64 7.08,92.4 7.88,91.59 7.88,90.28 7.47,89.87 LED46.2
  Bottom 0.102: IC3.7 5.56,95.03 7.08,93.52 v7.08,92.64
N$LEDB47  (via drill 0.25)  (1 unrouted)
  Top 0.102: LED47.2 v11.38,89.22 v11.39,89.21
  Bottom 0.102: v11.39,89.21 11.39,91.01 10.99,91.41 10.99,92.48 11.25,92.74 11.25,94.79 11.5,95.03 IC3.50
N$LEDB48  (via drill 0.25)  (1 unrouted)
  Top 0.102: v15.65,89.2 15.65,89.83 LED48.2
  Bottom 0.102: v15.65,89.2 15.65,89.32 15.19,89.78 14.44,89.78 14.23,90 14.23,90.57 14.56,90.9 15.69,90.9 16.31,91.52 16.31,93.39 16.14,93.56 12.28,93.56 IC3.53
N$LEDB49  (via drill 0.25)
  Top 0.102: LED49.2 v2.92,84.84
  Bottom 0.102: v2.92,84.84 2.92,86.69 3.32,87.1 IC4.25
N$LEDB50  (via drill 0.25)
  Top 0.102: v7.96,86.1 7.49,85.63 LED50.2
  Bottom 0.102: IC4.22 7.45,85.6 v7.96,86.1
N$LEDB51  (via drill 0.25)
  Top 0.102: LED51.2 10.65,85.63 v10.59,85.7
  Bottom 0.102: IC4.32 11.42,87.1 11.15,86.84 11.15,86.26 v10.59,85.7
N$LEDB52  (via drill 0.25)
  Top 0.102: LED52.2 v15.62,85.02
  Bottom 0.102: v15.62,85.02 14.77,85.02 14.18,85.6 IC4.35
N$LEDB53  (via drill 0.25)
  Top 0.102: v3.21,83.09 3.6,82.7 3.6,81.82 3.18,81.4 LED53.2
  Bottom 0.102: IC4.19 3.89,84.1 3.21,83.42 v3.21,83.09
N$LEDB54  (via drill 0.25)
  Top 0.102: v7.74,84.59 7.82,84.5 7.82,81.83 7.39,81.4 LED54.2
  Bottom 0.102: v7.74,84.59 7.24,84.59 7.13,84.47 6.53,84.47 6.33,84.28 6.33,82.78 6.04,82.49 5.57,82.49 5.46,82.6 IC4.16
N$LEDB55  (via drill 0.25)
  Top 0.102: LED55.2 11.23,81.4 10.63,82 10.63,82.55 v11.09,83.01
  Bottom 0.102: IC4.38 12.15,84 11.41,84 11.26,83.84 11.26,83.18 v11.09,83.01
N$LEDB56  (via drill 0.25)
  Top 0.102: LED56.2 v15.62,80.8 v15.61,80.8
  Bottom 0.102: IC4.41 13.57,82.6 13.82,82.35 14.46,82.35 15.61,81.2 v15.61,80.8
N$LEDB57  (via drill 0.25)
  Top 0.102: v3.26,78.96 3.62,78.6 3.62,77.42 3.36,77.17 LED57.2
  Bottom 0.102: IC4.13 3.69,81.1 3.52,80.93 3.52,79.21 v3.26,78.96
N$LEDB58  (via drill 0.25)
  Top 0.102: v7.42,78.74 7.63,78.74 7.8,78.57 7.8,77.51 7.45,77.17 LED58.2
  Bottom 0.102: IC4.10 5.43,79.6 6.51,78.51 7.18,78.51 v7.42,78.74
N$LEDB59  (via drill 0.25)
  Top 0.102: LED59.2 10.99,77.17 10.27,76.44 v10.22,76.44
  Bottom 0.102: v10.22,76.44 10.52,76.74 10.52,78.45 11.26,79.19 11.26,80.84 11.51,81.1 IC4.44
N$LEDB60  (via drill 0.25)
  Top 0.102: LED60.2 15.43,77.17 14.87,77.73 v14.87,78.97
  Bottom 0.102: IC4.47 13.68,79.6 14.2,79.08 14.76,79.08 v14.87,78.97
N$LEDB61  (via drill 0.25)
  Top 0.102: v3.11,75.34 3.19,75.34 3.57,74.96 3.57,73.23 3.28,72.93 LED61.2
  Bottom 0.102: v3.11,75.34 3.11,75.59 3.64,76.11 3.64,76.48 3.75,76.6 IC4.4
N$LEDB62  (via drill 0.25)
  Top 0.102: v7.08,75.7 7.08,75.47 7.88,74.66 7.88,73.34 7.47,72.93 LED62.2
  Bottom 0.102: IC4.7 5.56,78.1 7.08,76.59 v7.08,75.7
N$LEDB63  (via drill 0.25)
  Top 0.102: LED63.2 v11.38,72.29 v11.39,72.28
  Bottom 0.102: v11.39,72.28 11.39,74.08 10.99,74.48 10.99,75.55 11.25,75.8 11.25,77.85 11.5,78.1 IC4.50
N$LEDB64  (via drill 0.25)
  Top 0.102: v15.65,72.27 15.65,72.9 LED64.2
  Bottom 0.102: v15.65,72.27 15.65,72.39 15.19,72.85 14.44,72.85 14.23,73.06 14.23,73.64 14.56,73.97 15.69,73.97 16.31,74.59 16.31,76.45 16.14,76.62 12.28,76.62 IC4.53
N$LEDB65  (via drill 0.25)  (1 unrouted)
  Top 0.102: LED65.2 v2.92,67.91
  Bottom 0.102: v2.92,67.91 2.92,69.76 3.32,70.17 IC5.25
N$LEDB66  (via drill 0.25)  (1 unrouted)
  Top 0.102: v7.96,69.17 7.49,68.7 LED66.2
  Bottom 0.102: IC5.22 7.45,68.67 v7.96,69.17
N$LEDB67  (via drill 0.25)  (1 unrouted)
  Top 0.102: LED67.2 10.65,68.7 v10.59,68.76
  Bottom 0.102: IC5.32 11.42,70.17 11.15,69.9 11.15,69.33 v10.59,68.76
N$LEDB68  (via drill 0.25)  (1 unrouted)
  Top 0.102: LED68.2 v15.62,68.08
  Bottom 0.102: v15.62,68.08 14.77,68.08 14.18,68.67 IC5.35
N$LEDB69  (via drill 0.25)
  Top 0.102: v3.21,66.16 3.6,65.77 3.6,64.89 3.18,64.47 LED69.2
  Bottom 0.102: IC5.19 3.89,67.17 3.21,66.49 v3.21,66.16
N$LEDB70  (via drill 0.25)
  Top 0.102: v7.74,67.65 7.82,67.57 7.82,64.9 7.39,64.47 LED70.2
  Bottom 0.102: v7.74,67.65 7.24,67.65 7.13,67.54 6.53,67.54 6.33,67.34 6.33,65.84 6.04,65.56 5.57,65.56 5.46,65.67 IC5.16
N$LEDB71  (via drill 0.25)
  Top 0.102: LED71.2 11.23,64.47 10.63,65.07 10.63,65.62 v11.09,66.08
  Bottom 0.102: IC5.38 12.15,67.07 11.41,67.07 11.26,66.91 11.26,66.24 v11.09,66.08
N$LEDB72  (via drill 0.25)
  Top 0.102: LED72.2 v15.62,63.87 v15.61,63.86
  Bottom 0.102: IC5.41 13.57,65.67 13.82,65.42 14.46,65.42 15.61,64.27 v15.61,63.86
N$LEDB73  (via drill 0.25)
  Top 0.102: v3.26,62.02 3.62,61.66 3.62,60.49 3.36,60.23 LED73.2
  Bottom 0.102: IC5.13 3.69,64.17 3.52,64 3.52,62.28 v3.26,62.02
N$LEDB74  (via drill 0.25)
  Top 0.102: v7.42,61.81 7.63,61.81 7.8,61.64 7.8,60.58 7.45,60.23 LED74.2
  Bottom 0.102: IC5.10 5.43,62.67 6.51,61.58 7.18,61.58 v7.42,61.81
N$LEDB75  (via drill 0.25)
  Top 0.102: LED75.2 10.99,60.23 10.27,59.51 v10.22,59.51
  Bottom 0.102: v10.22,59.51 10.52,59.81 10.52,61.52 11.26,62.25 11.26,63.91 11.51,64.17 IC5.44
N$LEDB76  (via drill 0.25)
  Top 0.102: LED76.2 15.43,60.23 14.87,60.8 v14.87,62.04
  Bottom 0.102: IC5.47 13.68,62.67 14.2,62.14 14.76,62.14 v14.87,62.04
N$LEDB77  (via drill 0.25)  (1 unrouted)
  Top 0.102: v3.11,58.41 3.19,58.41 3.57,58.03 3.57,56.29 3.28,56 LED77.2
  Bottom 0.102: v3.11,58.41 3.11,58.66 3.64,59.18 3.64,59.55 3.75,59.67 IC5.4
N$LEDB78  (via drill 0.25)  (1 unrouted)
  Top 0.102: v7.08,58.77 7.08,58.53 7.88,57.73 7.88,56.41 7.47,56 LED78.2
  Bottom 0.102: IC5.7 5.56,61.17 7.08,59.65 v7.08,58.77
N$LEDB79  (via drill 0.25)  (1 unrouted)
  Top 0.102: LED79.2 11.38,55.35 v11.39,55.34
  Bottom 0.102: v11.39,55.34 11.39,57.14 10.99,57.55 10.99,58.61 11.25,58.87 11.25,60.92 11.5,61.17 IC5.50
N$LEDB80  (via drill 0.25)  (1 unrouted)
  Top 0.102: v15.65,55.33 15.65,55.97 LED80.2
  Bottom 0.102: v15.65,55.33 15.65,55.46 15.19,55.92 14.44,55.92 14.23,56.13 14.23,56.7 14.56,57.03 15.69,57.03 16.31,57.65 16.31,59.52 16.14,59.69 12.28,59.69 IC5.53
N$LEDB81  (via drill 0.25)  (1 unrouted)
  Top 0.102: LED81.2 v2.92,50.98 v2.92,50.97
  Bottom 0.102: v2.92,50.97 2.92,52.83 3.32,53.23 IC6.25
N$LEDB82  (via drill 0.25)  (1 unrouted)
  Top 0.102: v7.96,52.24 7.49,51.77 LED82.2
  Bottom 0.102: IC6.22 7.45,51.73 v7.96,52.24
N$LEDB83  (via drill 0.25)  (1 unrouted)
  Top 0.102: LED83.2 10.65,51.77 v10.59,51.83
  Bottom 0.102: IC6.32 11.42,53.23 11.15,52.97 11.15,52.4 v10.59,51.83
N$LEDB84  (via drill 0.25)  (1 unrouted)
  Top 0.102: LED84.2 v15.62,51.15
  Bottom 0.102: v15.62,51.15 14.77,51.15 14.18,51.73 IC6.35
N$LEDB85  (via drill 0.25)  (2 unrouted)
  Top 0.102: v3.21,49.22 3.6,48.83 3.6,47.95 3.18,47.53 LED85.2
  Bottom 0.102: IC6.19 3.89,50.23 3.21,49.55 v3.21,49.22
N$LEDB86  (via drill 0.25)  (2 unrouted)
  Top 0.102: v7.74,50.72 7.82,50.64 7.82,47.96 7.39,47.53 LED86.2
  Bottom 0.102: v7.74,50.72 7.24,50.72 7.13,50.61 6.53,50.61 6.33,50.41 6.33,48.91 6.04,48.62 5.57,48.62 5.46,48.73 IC6.16
N$LEDB87  (via drill 0.25)  (2 unrouted)
  Top 0.102: LED87.2 11.23,47.53 10.63,48.14 10.63,48.69 v11.09,49.15
  Bottom 0.102: IC6.38 12.15,50.13 11.41,50.13 11.26,49.98 11.26,49.31 v11.09,49.15
N$LEDB88  (via drill 0.25)  (2 unrouted)
  Top 0.102: LED88.2 v15.62,46.94 v15.61,46.93
  Bottom 0.102: IC6.41 13.57,48.73 13.82,48.48 14.46,48.48 15.61,47.33 v15.61,46.93
N$LEDB89  (via drill 0.25)  (1 unrouted)
  Top 0.102: v3.26,45.09 3.62,44.73 3.62,43.56 3.36,43.3 LED89.2
  Bottom 0.102: IC6.13 3.69,47.23 3.52,47.06 3.52,45.35 v3.26,45.09
N$LEDB90  (via drill 0.25)  (1 unrouted)
  Top 0.102: v7.42,44.87 7.63,44.87 7.8,44.7 7.8,43.65 7.45,43.3 LED90.2
  Bottom 0.102: IC6.10 5.43,45.73 6.51,44.64 7.18,44.64 v7.42,44.87
N$LEDB91  (via drill 0.25)  (1 unrouted)
  Top 0.102: LED91.2 10.99,43.3 10.27,42.58 v10.22,42.58
  Bottom 0.102: v10.22,42.58 10.52,42.87 10.52,44.58 11.26,45.32 11.26,46.98 11.51,47.23 IC6.44
N$LEDB92  (via drill 0.25)  (1 unrouted)
  Top 0.102: LED92.2 15.43,43.3 14.87,43.86 v14.87,45.11
  Bottom 0.102: IC6.47 13.68,45.73 14.2,45.21 14.76,45.21 v14.87,45.11
N$LEDB93  (via drill 0.25)  (1 unrouted)
  Top 0.102: v3.11,41.47 3.19,41.47 3.57,41.09 3.57,39.36 3.28,39.07 LED93.2
  Bottom 0.102: v3.11,41.47 3.11,41.72 3.64,42.25 3.64,42.62 3.75,42.73 IC6.4
N$LEDB94  (via drill 0.25)  (1 unrouted)
  Top 0.102: v7.08,41.84 7.08,41.6 7.88,40.8 7.88,39.47 7.47,39.07 LED94.2
  Bottom 0.102: IC6.7 5.56,44.23 7.08,42.72 v7.08,41.84
N$LEDB95  (via drill 0.25)  (1 unrouted)
  Top 0.102: LED95.2 11.38,38.42 v11.39,38.41
  Bottom 0.102: v11.39,38.41 11.39,40.21 10.99,40.61 10.99,41.68 11.25,41.94 11.25,43.99 11.5,44.23 IC6.50
N$LEDB96  (via drill 0.25)  (1 unrouted)
  Top 0.102: v15.65,38.4 15.65,39.03 LED96.2
  Bottom 0.102: v15.65,38.4 15.65,38.52 15.19,38.98 14.44,38.98 14.23,39.2 14.23,39.77 14.56,40.1 15.69,40.1 16.31,40.72 16.31,42.59 16.14,42.75 12.28,42.75 IC6.53
N$LEDB97  (via drill 0.25)
  Top 0.102: LED97.2 v2.92,34.04
  Bottom 0.102: v2.92,34.04 2.92,35.89 3.32,36.3 IC7.25
N$LEDB98  (via drill 0.25)
  Top 0.102: v7.96,35.31 7.49,34.83 LED98.2
  Bottom 0.102: IC7.22 7.45,34.8 v7.96,35.31
N$LEDB99  (via drill 0.25)
  Top 0.102: LED99.2 10.65,34.83 v10.59,34.9
  Bottom 0.102: IC7.32 11.42,36.3 11.15,36.03 11.15,35.46 v10.59,34.9
N$LEDB100  (via drill 0.25)
  Top 0.102: LED100.2 v15.62,34.22
  Bottom 0.102: v15.62,34.22 14.77,34.22 14.18,34.8 IC7.35
N$LEDB101  (via drill 0.25)
  Top 0.102: v3.21,32.29 3.6,31.9 3.6,31.02 3.18,30.6 LED101.2
  Bottom 0.102: IC7.19 3.89,33.3 3.21,32.62 v3.21,32.29
N$LEDB102  (via drill 0.25)
  Top 0.102: v7.74,33.79 7.82,33.7 7.82,31.03 7.39,30.6 LED102.2
  Bottom 0.102: v7.74,33.79 7.24,33.79 7.13,33.67 6.53,33.67 6.33,33.48 6.33,31.97 6.04,31.69 5.57,31.69 5.46,31.8 IC7.16
N$LEDB103  (via drill 0.25)
  Top 0.102: LED103.2 11.23,30.6 10.63,31.2 10.63,31.75 v11.09,32.21
  Bottom 0.102: IC7.38 12.15,33.2 11.41,33.2 11.26,33.04 11.26,32.38 v11.09,32.21
N$LEDB104  (via drill 0.25)
  Top 0.102: LED104.2 v15.62,30 v15.61,30
  Bottom 0.102: IC7.41 13.57,31.8 13.82,31.55 14.46,31.55 15.61,30.4 v15.61,30
N$LEDB105  (via drill 0.25)
  Top 0.102: v3.26,28.16 3.62,27.8 3.62,26.62 3.36,26.37 LED105.2
  Bottom 0.102: IC7.13 3.69,30.3 3.52,30.13 3.52,28.41 v3.26,28.16
N$LEDB106  (via drill 0.25)
  Top 0.102: v7.42,27.94 7.63,27.94 7.8,27.77 7.8,26.71 7.45,26.37 LED106.2
  Bottom 0.102: IC7.10 5.43,28.8 6.51,27.71 7.18,27.71 v7.42,27.94
N$LEDB107  (via drill 0.25)
  Top 0.102: LED107.2 10.99,26.37 10.27,25.64 v10.22,25.64
  Bottom 0.102: v10.22,25.64 10.52,25.94 10.52,27.65 11.26,28.39 11.26,30.04 11.51,30.3 IC7.44
N$LEDB108  (via drill 0.25)
  Top 0.102: LED108.2 15.43,26.37 14.87,26.93 v14.87,28.17
  Bottom 0.102: IC7.47 13.68,28.8 14.2,28.28 14.76,28.28 v14.87,28.17
N$LEDB109  (via drill 0.25)
  Top 0.102: v3.11,24.54 3.19,24.54 3.57,24.16 3.57,22.43 3.28,22.13 LED109.2
  Bottom 0.102: v3.11,24.54 3.11,24.79 3.64,25.31 3.64,25.69 3.75,25.8 IC7.4
N$LEDB110  (via drill 0.25)
  Top 0.102: v7.08,24.9 7.08,24.67 7.88,23.86 7.88,22.54 7.47,22.13 LED110.2
  Bottom 0.102: IC7.7 5.56,27.3 7.08,25.79 v7.08,24.9
N$LEDB111  (via drill 0.25)
  Top 0.102: LED111.2 v11.38,21.49 v11.39,21.48
  Bottom 0.102: v11.39,21.48 11.39,23.28 10.99,23.68 10.99,24.75 11.25,25 11.25,27.05 11.5,27.3 IC7.50
N$LEDB112  (via drill 0.25)
  Top 0.102: v15.65,21.47 15.65,22.1 LED112.2
  Bottom 0.102: v15.65,21.47 15.65,21.59 15.19,22.05 14.44,22.05 14.23,22.26 14.23,22.84 14.56,23.17 15.97,23.17 16.38,23.58 16.38,25.58 16.14,25.82 12.28,25.82 IC7.53
N$LEDB113  (via drill 0.25)  (1 unrouted)
  Top 0.102: LED113.2 v2.92,17.11
  Bottom 0.102: v2.92,17.11 2.92,18.96 3.32,19.37 IC8.25
N$LEDB114  (via drill 0.25)  (1 unrouted)
  Top 0.102: v7.96,18.37 7.49,17.9 LED114.2
  Bottom 0.102: IC8.22 7.45,17.87 v7.96,18.37
N$LEDB115  (via drill 0.25)  (1 unrouted)
  Top 0.102: LED115.2 10.65,17.9 v10.59,17.96
  Bottom 0.102: IC8.32 11.42,19.37 11.15,19.1 11.15,18.53 v10.59,17.96
N$LEDB116  (via drill 0.25)  (1 unrouted)
  Top 0.102: LED116.2 v15.62,17.28
  Bottom 0.102: v15.62,17.28 14.77,17.28 14.18,17.87 IC8.35
N$LEDB117  (via drill 0.25)
  Top 0.102: v3.21,15.36 3.6,14.97 3.6,14.09 3.18,13.67 LED117.2
  Bottom 0.102: IC8.19 3.89,16.37 3.21,15.69 v3.21,15.36
N$LEDB118  (via drill 0.25)
  Top 0.102: v7.74,16.85 7.82,16.77 7.82,14.1 7.39,13.67 LED118.2
  Bottom 0.102: v7.74,16.85 7.24,16.85 7.13,16.74 6.53,16.74 6.33,16.54 6.33,15.04 6.04,14.76 5.57,14.76 5.46,14.87 IC8.16
N$LEDB119  (via drill 0.25)
  Top 0.102: LED119.2 11.23,13.67 10.63,14.27 10.63,14.82 v11.09,15.28
  Bottom 0.102: IC8.38 12.15,16.27 11.41,16.27 11.26,16.11 11.26,15.44 v11.09,15.28
N$LEDB120  (via drill 0.25)
  Top 0.102: LED120.2 v15.62,13.07 v15.61,13.06
  Bottom 0.102: IC8.41 13.57,14.87 13.82,14.62 14.46,14.62 15.61,13.47 v15.61,13.06
N$LEDG1  (via drill 0.25)
  Top 0.102: LED1.1 v2.92,138.67 v2.92,138.68
  Bottom 0.102: v2.92,138.68 3.15,138.9 IC1.27
N$LEDG2  (via drill 0.25)
  Top 0.102: LED2.1 7.15,137.73 v7.65,138.23
  Bottom 0.102: v7.65,138.23 6.9,138.98 6.02,138.98 5.7,138.67 5.7,137.68 5.42,137.4 IC1.24
N$LEDG3  (via drill 0.25)
  Top 0.102: LED3.1 11.38,138.3 v10.85,138.83
  Bottom 0.102: IC1.30 10.92,138.9 v10.85,138.83
N$LEDG4  (via drill 0.25)
  Top 0.102: LED4.1 v15.61,137.98
  Bottom 0.102: IC1.33 13.12,137.4 13.44,137.72 13.44,138.19 13.74,138.49 14.29,138.49 14.8,137.98 v15.61,137.98
N$LEDG5  (via drill 0.25)
  Top 0.102: LED5.1 2.65,133.36 2.65,134.9 v2.67,134.92
  Bottom 0.102: v2.67,134.92 2.96,134.92 3.94,135.9 IC1.21
N$LEDG6  (via drill 0.25)
  Top 0.102: LED6.1 6.82,133.43 6.82,135.71 v6.91,135.81
  Bottom 0.102: IC1.18 5.84,134.4 6.02,134.57 6.02,135.21 6.61,135.81 v6.91,135.81
N$LEDG7  (via drill 0.25)
  Top 0.102: LED7.1 11.74,133.46 11.74,134.83 10.95,135.62 v10.95,135.7
  Bottom 0.102: IC1.36 11.35,135.9 11.15,135.7 v10.95,135.7
N$LEDG8  (via drill 0.25)
  Top 0.102: LED8.1 v15.61,133.76
  Bottom 0.102: v15.61,133.76 14.76,133.76 14.13,134.4 IC1.39
N$LEDG9  (via drill 0.25)
  Top 0.102: v2.73,131.49 2.65,131.41 2.65,129.14 LED9.1
  Bottom 0.102: v2.73,131.49 2.73,132.12 3.5,132.9 IC1.15
N$LEDG10  (via drill 0.25)
  Top 0.102: LED10.1 6.84,129.18 6.84,129.75 v6.72,129.87
  Bottom 0.102: v6.72,129.87 6.58,129.87 6.33,130.12 6.33,131.01 5.94,131.4 IC1.12
N$LEDG11  (via drill 0.25)
  Top 0.102: v9.36,129.88 9.49,130.01 10.75,130.01 11.12,129.64 11.12,129.13 LED11.1
  Bottom 0.102: v9.36,129.88 9.49,130.01 10.53,130.01 10.72,130.2 10.72,132.11 11.51,132.9 IC1.42
N$LEDG12  (via drill 0.25)
  Top 0.102: LED12.1 v15.62,129.53
  Bottom 0.102: IC1.45 13.29,131.4 13.72,130.97 14.93,130.97 15.62,130.28 v15.62,129.53
N$LEDG13  (via drill 0.25)
  Top 0.102: LED13.1 3.19,124.91 3.19,125.3 2.57,125.92 2.57,127.08 v2.76,127.27
  Bottom 0.102: IC1.6 3.29,128.4 2.76,127.86 v2.76,127.27
N$LEDG14  (via drill 0.25)
  Top 0.102: LED14.1 7.15,125.13 v7.3,125.28
  Bottom 0.102: v7.3,125.28 7.96,125.94 7.96,127.45 5.51,129.9 IC1.9
N$LEDG15  (via drill 0.25)
  Top 0.102: LED15.1 11.38,124.77 10.78,125.37 v9.96,125.37
  Bottom 0.102: v9.96,125.37 10.49,125.9 10.49,126.54 10.76,126.81 10.76,129.18 11.48,129.9 IC1.48
N$LEDG16  (via drill 0.25)
  Top 0.102: v16.36,128.4 16.43,128.33 16.43,124.86 16.2,124.63 LED16.1
  Bottom 0.102: v16.36,128.4 IC1.51
N$LEDG17  (via drill 0.25)  (1 unrouted)
  Top 0.102: LED17.1 v2.92,121.74
  Bottom 0.102: v2.92,121.74 3.15,121.97 IC2.27
N$LEDG18  (via drill 0.25)  (1 unrouted)
  Top 0.102: LED18.1 7.15,120.8 v7.65,121.3
  Bottom 0.102: v7.65,121.3 6.9,122.05 6.02,122.05 5.7,121.74 5.7,120.75 5.42,120.47 IC2.24
N$LEDG19  (via drill 0.25)  (1 unrouted)
  Top 0.102: LED19.1 11.38,121.37 v10.85,121.9
  Bottom 0.102: IC2.30 10.92,121.97 v10.85,121.9
N$LEDG20  (via drill 0.25)  (1 unrouted)
  Top 0.102: LED20.1 v15.61,121.05
  Bottom 0.102: IC2.33 13.12,120.47 13.44,120.78 13.44,121.25 13.74,121.56 14.29,121.56 14.8,121.05 v15.61,121.05
N$LEDG21  (via drill 0.25)
  Top 0.102: LED21.1 2.65,116.43 2.65,117.97 v2.67,117.98
  Bottom 0.102: v2.67,117.98 2.96,117.98 3.94,118.97 IC2.21
N$LEDG22  (via drill 0.25)
  Top 0.102: LED22.1 6.82,116.5 6.82,118.78 v6.91,118.87
  Bottom 0.102: IC2.18 5.84,117.47 6.02,117.64 6.02,118.28 6.61,118.87 v6.91,118.87
N$LEDG23  (via drill 0.25)
  Top 0.102: LED23.1 11.74,116.52 11.74,117.9 10.95,118.69 v10.95,118.76
  Bottom 0.102: IC2.36 11.35,118.97 11.15,118.76 v10.95,118.76
N$LEDG24  (via drill 0.25)
  Top 0.102: LED24.1 v15.61,116.83
  Bottom 0.102: v15.61,116.83 14.76,116.83 14.13,117.47 IC2.39
N$LEDG25  (via drill 0.25)
  Top 0.102: v2.73,114.55 2.65,114.47 2.65,112.2 LED25.1
  Bottom 0.102: v2.73,114.55 2.73,115.19 3.5,115.97 IC2.15
N$LEDG26  (via drill 0.25)
  Top 0.102: LED26.1 6.84,112.24 6.84,112.81 v6.72,112.94
  Bottom 0.102: v6.72,112.94 6.58,112.94 6.33,113.19 6.33,114.08 5.94,114.47 IC2.12
N$LEDG27  (via drill 0.25)
  Top 0.102: v9.36,112.95 9.49,113.08 10.75,113.08 11.12,112.71 11.12,112.2 LED27.1
  Bottom 0.102: v9.36,112.95 9.49,113.08 10.53,113.08 10.72,113.27 10.72,115.18 11.51,115.96 IC2.42
N$LEDG28  (via drill 0.25)
  Top 0.102: LED28.1 v15.62,112.59 v15.62,112.6
  Bottom 0.102: IC2.45 13.29,114.47 13.72,114.04 14.93,114.04 15.62,113.35 v15.62,112.6
N$LEDG29  (via drill 0.25)  (1 unrouted)
  Top 0.102: LED29.1 3.19,107.98 3.19,108.37 2.57,108.99 2.57,110.15 v2.76,110.34
  Bottom 0.102: IC2.6 3.29,111.47 2.76,110.93 v2.76,110.34
N$LEDG30  (via drill 0.25)  (1 unrouted)
  Top 0.102: LED30.1 7.15,108.2 v7.3,108.35
  Bottom 0.102: v7.3,108.35 7.96,109.01 7.96,110.52 5.51,112.97 IC2.9
N$LEDG31  (via drill 0.25)  (1 unrouted)
  Top 0.102: LED31.1 11.38,107.84 10.78,108.44 v9.96,108.44
  Bottom 0.102: v9.96,108.44 10.49,108.96 10.49,109.6 10.76,109.88 10.76,112.25 11.48,112.97 IC2.48
N$LEDG32  (via drill 0.25)  (1 unrouted)
  Top 0.102: v16.36,111.46 16.43,111.39 16.43,107.93 16.2,107.7 LED32.1
  Bottom 0.102: v16.36,111.46 v16.36,111.47 IC2.51
N$LEDG33  (via drill 0.25)  (1 unrouted)
  Top 0.102: LED33.1 v2.92,104.81
  Bottom 0.102: v2.92,104.81 3.15,105.03 IC3.27
N$LEDG34  (via drill 0.25)  (1 unrouted)
  Top 0.102: LED34.1 7.15,103.87 v7.65,104.37
  Bottom 0.102: v7.65,104.37 6.9,105.12 6.02,105.12 5.7,104.81 5.7,103.82 5.42,103.53 IC3.24
N$LEDG35  (via drill 0.25)  (1 unrouted)
  Top 0.102: LED35.1 11.38,104.44 v10.85,104.97
  Bottom 0.102: IC3.30 10.92,105.03 v10.85,104.97
N$LEDG36  (via drill 0.25)  (1 unrouted)
  Top 0.102: LED36.1 v15.61,104.12
  Bottom 0.102: IC3.33 13.12,103.53 13.44,103.85 13.44,104.32 13.74,104.63 14.29,104.63 14.8,104.12 v15.61,104.12
N$LEDG37  (via drill 0.25)  (2 unrouted)
  Top 0.102: LED37.1 2.65,99.5 2.65,101.03 v2.67,101.05
  Bottom 0.102: v2.67,101.05 2.96,101.05 3.94,102.03 IC3.21
N$LEDG38  (via drill 0.25)  (2 unrouted)
  Top 0.102: LED38.1 6.82,99.56 6.82,101.84 v6.91,101.94
  Bottom 0.102: IC3.18 5.84,100.53 6.02,100.71 6.02,101.34 6.61,101.94 v6.91,101.94
N$LEDG39  (via drill 0.25)  (2 unrouted)
  Top 0.102: LED39.1 11.74,99.59 11.74,100.97 10.95,101.75 v10.95,101.83
  Bottom 0.102: IC3.36 11.35,102.03 11.15,101.83 v10.95,101.83
N$LEDG40  (via drill 0.25)  (2 unrouted)
  Top 0.102: LED40.1 v15.61,99.9
  Bottom 0.102: v15.61,99.9 14.76,99.9 14.13,100.53 IC3.39
N$LEDG41  (via drill 0.25)  (1 unrouted)
  Top 0.102: v2.73,97.62 2.65,97.54 2.65,95.27 LED41.1
  Bottom 0.102: v2.73,97.62 2.73,98.25 3.5,99.03 IC3.15
N$LEDG42  (via drill 0.25)  (1 unrouted)
  Top 0.102: LED42.1 6.84,95.31 6.84,95.88 v6.72,96
  Bottom 0.102: v6.72,96 6.58,96 6.33,96.26 6.33,97.15 5.94,97.53 IC3.12
N$LEDG43  (via drill 0.25)  (1 unrouted)
  Top 0.102: v9.36,96.02 9.49,96.14 10.75,96.14 11.12,95.78 11.12,95.27 LED43.1
  Bottom 0.102: v9.36,96.02 9.49,96.14 10.53,96.14 10.72,96.34 10.72,98.24 11.51,99.03 IC3.42
N$LEDG44  (via drill 0.25)  (1 unrouted)
  Top 0.102: LED44.1 v15.62,95.66
  Bottom 0.102: IC3.45 13.29,97.53 13.72,97.1 14.93,97.1 15.62,96.42 v15.62,95.66
N$LEDG45  (via drill 0.25)  (1 unrouted)
  Top 0.102: LED45.1 3.19,91.04 3.19,91.43 2.57,92.06 2.57,93.22 v2.76,93.4
  Bottom 0.102: IC3.6 3.29,94.53 2.76,94 v2.76,93.4
N$LEDG46  (via drill 0.25)  (1 unrouted)
  Top 0.102: LED46.1 7.15,91.27 v7.3,91.41
  Bottom 0.102: v7.3,91.41 7.96,92.08 7.96,93.58 5.51,96.03 IC3.9
N$LEDG47  (via drill 0.25)  (1 unrouted)
  Top 0.102: LED47.1 11.38,90.9 10.78,91.51 v9.96,91.51
  Bottom 0.102: v9.96,91.51 10.49,92.03 10.49,92.67 10.76,92.94 10.76,95.31 11.48,96.03 IC3.48
N$LEDG48  (via drill 0.25)  (1 unrouted)
  Top 0.102: v16.36,94.53 16.43,94.46 16.43,91 16.2,90.77 LED48.1
  Bottom 0.102: v16.36,94.53 IC3.51
N$LEDG49  (via drill 0.25)
  Top 0.102: LED49.1 v2.92,87.87 v2.92,87.88
  Bottom 0.102: v2.92,87.88 3.15,88.1 IC4.27
N$LEDG50  (via drill 0.25)
  Top 0.102: LED50.1 7.15,86.93 v7.65,87.43
  Bottom 0.102: v7.65,87.43 6.9,88.18 6.02,88.18 5.7,87.87 5.7,86.88 5.42,86.6 IC4.24
N$LEDG51  (via drill 0.25)
  Top 0.102: LED51.1 11.38,87.5 v10.85,88.03
  Bottom 0.102: IC4.30 10.92,88.1 v10.85,88.03
N$LEDG52  (via drill 0.25)
  Top 0.102: LED52.1 v15.61,87.18
  Bottom 0.102: IC4.33 13.12,86.6 13.44,86.92 13.44,87.39 13.74,87.69 14.29,87.69 14.8,87.18 v15.61,87.18